# Altium schematic sheet 407-io.schdoc
size A4
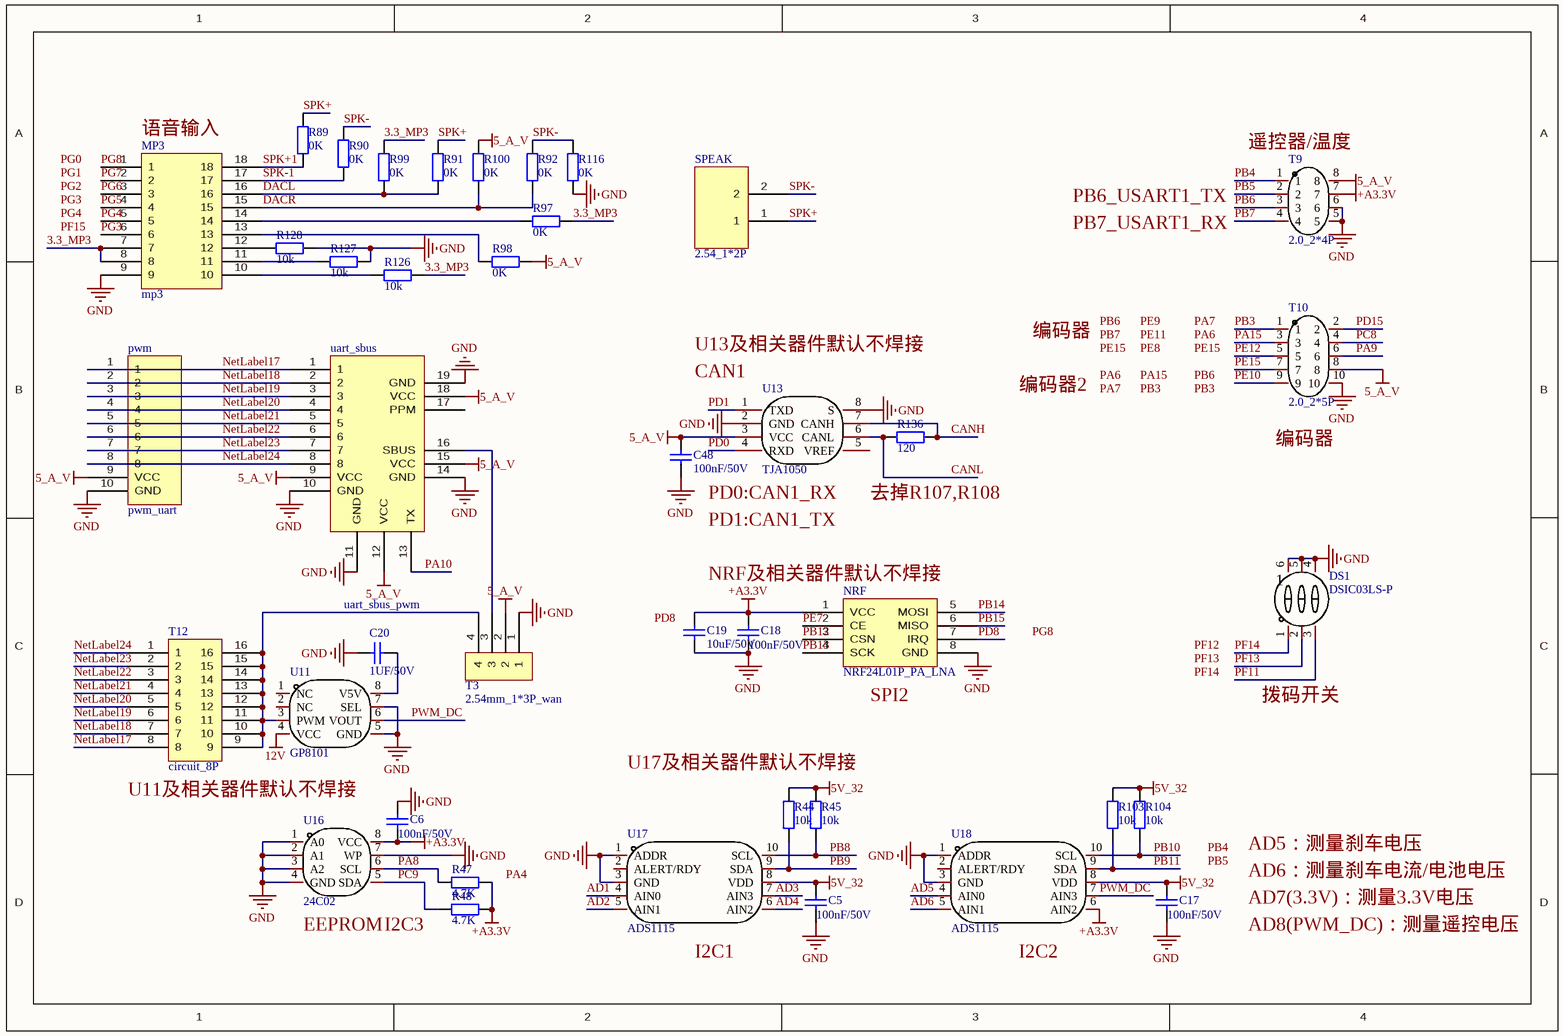
[diagram p0: 407-io.schdoc]

## Parts
C5  100nF/50V
C6  100nF/50V
C17  100nF/50V
C18  100nF/50V
C19  10uF/50V
C20  1UF/50V
C48  100nF/50V
DS1  DSIC03LS-P  [DS1040-03RN]
MP3  mp3  [MP3]
NRF  NRF24L01P_PA_LNA  [NRF24L01P_PA_LNA]
pwm  pwm_uart  [pwm_uart]
R44  10k  [R0603_L]
R45  10k  [R0603_L]
R47  4.7K
R48  4.7K
R89  0K  [R0603_L]
R90  0K  [R0603_L]
R91  0K  [R0603_L]
R92  0K  [R0603_L]
R97  0K  [R0603_L]
R98  0K  [R0603_L]
R99  0K  [R0603_L]
R100  0K  [R0603_L]
R103  10k  [R0603_L]
R104  10k  [R0603_L]
R116  0K  [R0603_L]
R126  10k  [R0603_L]
R127  10k  [R0603_L]
R128  10k  [R0603_L]
R136  120
SPEAK  2.54_1*2P  [2.54_1*2P]
T3  2.54mm_1*3P_wan
T9  2.0_2*4P  [2.0_2*4P]
T10  2.0_2*5P  [2.0_2*5P]
T12  circuit_8P  [circuit_8P]
U11  GP8101  [GP8101]
U13  TJA1050  [TJA1050]
U16  24C02  [24C02]
U17  ADS1115  [ADS1115]
U18  ADS1115  [ADS1115]
uart_sbus  uart_sbus_pwm  [uart_sbus_pwm]

## Nets
5_A_V: C48.2 pwm.9(VCC) R98.2 R100.2 T3.2 T9.8 T10.8 U13.3(VCC) uart_sbus.9(VCC) uart_sbus.12(VCC) uart_sbus.15(VCC) uart_sbus.18(VCC)
5V_32: C5.1 C17.1 R44.1 R45.1 R103.1 R104.1 U17.8(VDD) U18.8(VDD)
12V: U11.4(VCC)
+A3.3V: C6.2 C18.1 C19.1 NRF.1(VCC) R47.2 R48.2 T9.7 U16.8(VCC) U18.6(AIN2)
GND: C5.2 C6.1 C17.2 C18.2 C19.2 C20.2 C48.1 DS1.4(PIN4) DS1.5(PIN5) DS1.6(PIN6) MP3.9 NRF.8(GND) pwm.10(GND) R116.1 R127.2 R128.2 T3.1 T9.5 T9.6 T10.10 U11.5(GND) U11.7(SEL) U13.2(GND) U13.8(S) U16.1(A0) U16.2(A1) U16.3(A2) U16.4(GND) U16.7(WP) U17.1(ADDR) U17.3(GND) U18.1(ADDR) U18.3(GND) uart_sbus.10(GND) uart_sbus.11(GND) uart_sbus.14(GND) uart_sbus.19(GND)
3.3_MP3: MP3.7 MP3.8 R97.2 R99.2 R126.2
AD1: U17.4(AIN0)
AD2: U17.5(AIN1)
AD3: U17.7(AIN3)
AD4: U17.6(AIN2)
AD5: U18.4(AIN0)
AD6: U18.5(AIN1)
CANH: R136.2 U13.7(CANH)
CANL: R136.1 U13.6(CANL)
DACL: MP3.16 R91.1 R99.1
DACR: MP3.15 R92.1 R100.1
NetLabel17: pwm.1 T12.8 uart_sbus.1
NetLabel18: pwm.2 T12.7 uart_sbus.2
NetLabel19: pwm.3 T12.6 uart_sbus.3
NetLabel20: pwm.4 T12.5 uart_sbus.4
NetLabel21: pwm.5 T12.4 uart_sbus.5
NetLabel22: pwm.6 T12.3 uart_sbus.6
NetLabel23: pwm.7 T12.2 uart_sbus.7
NetLabel24: pwm.8 T12.1 uart_sbus.8
PA8: R47.1 U16.6(SCL)
PA9: T10.6
PA10: uart_sbus.13(TX)
PA15: T10.3
PB3: T10.1
PB4: T9.1
PB5: T9.2
PB6: T9.3
PB7: T9.4
PB8: R45.2 U17.10(SCL)
PB9: R44.2 U17.9(SDA)
PB10: R104.2 U18.10(SCL)
PB11: R103.2 U18.9(SDA)
PB12: NRF.3(CSN)
PB13: NRF.4(SCK)
PB14: NRF.5(MOSI)
PB15: NRF.6(MISO)
PC8: T10.4
PC9: R48.1 U16.5(SDA)
PD0: U13.4(RXD)
PD1: U13.1(TXD)
PD8: NRF.7(IRQ)
PD15: T10.2
PE7: NRF.2(CE)
PE10: T10.9
PE12: T10.5
PE15: T10.7
PF11: DS1.3(PIN3)
PF13: DS1.2(PIN2)
PF14: DS1.1(PIN1)
PG3: MP3.6
PG4: MP3.5
PG5: MP3.4
PG6: MP3.3
PG7: MP3.2
PG8: MP3.1
PWM_DC: U11.6(VOUT) U18.7(AIN3)
SPK+: R89.2 R91.2 SPEAK.1
SPK+1: MP3.18 R89.1
SPK-: R90.2 R92.2 R116.2 SPEAK.2
SPK-1: MP3.17 R90.1
NetC20_1: C20.1 U11.8(V5V)
NetMP3_10: MP3.10 R126.1
NetMP3_11: MP3.11 R127.1
NetMP3_12: MP3.12 R128.1
NetMP3_13: MP3.13 R98.1
NetMP3_14: MP3.14 R97.1
NetT3_3: T3.3 uart_sbus.16(SBUS)
NetT3_4: T3.4 T12.9 T12.10 T12.11 T12.12 T12.13 T12.14 T12.15 T12.16 U11.3(PWM)

Not connected (* = marked no-connect by the designer): U11 1(NC) 2(NC); U13 5(VREF); U17 2(ALERT/RDY); U18 2(ALERT/RDY); uart_sbus 17(PPM)

## Notes on the sheet
- (near MP3) 语音输入
- (near T9) 遥控器/温度
- PB6_USART1_TX
- PB7_USART1_RX
- (near U13) CAN1
- U13及相关器件默认不焊接
- 编码器
- 编码器2
- (near T10) 编码器
- PD0:CAN1_RX
- 去掉R107,R108
- PD1:CAN1_TX
- NRF及相关器件默认不焊接
- (near NRF) SPI2
- 拨码开关
- U17及相关器件默认不焊接
- (near T12) U11及相关器件默认不焊接
- AD5：测量刹车电压
- AD7(3.3V)：测量3.3V电压
- AD6：测量刹车电流/电池电压
- (near U16) EEPROM
- I2C3
- (near U17) I2C1
- (near U18) I2C2
- AD8(PWM_DC)：测量遥控电压
- Labels drawn without touching a wire or pin: PA4, PA6, PA7, PA15, PB3, PB4, PB5, PB6, PB7, PD8, PE8, PE9, PE11, PE15, PF12, PF13, PF14, PF15, PG0, PG1, PG2, PG3, PG4, PG8

## Library data of the parts
C5 C6 C17-C20 C48 = Cap: Capacitor; Published: 8-Jun-2000; LatestRevisionDate: 17-Jul-2002; LatestRevisionNote: Re-released for DXP Platform.; PackageReference: RAD-0.3; Publisher: Altium Limited; PackageDescription: Radial Cap, Thru-Hole; 2 Leads; 0.3 in Pin Spacing
  C5 C6 C17 C18 C48: Value: 100nF/50V
  C19: Value: 10uF/50V
  C20: Value: 1UF/50V
R44 R45 R103 R104 R126-R128 = Res2: Resistor; Value: 0K; Published: 8-Jun-2000; LatestRevisionDate: 17-Jul-2002; LatestRevisionNote: Re-released for DXP Platform.; PackageReference: AXIAL-0.4; Publisher: Altium Limited; PackageDescription: Axial Device, Thru-Hole; 2 Leads; 0.4 in Pin Spacing
R47 R48 R89-R92 R97-R100 R116 = Res2: Resistor; Published: 8-Jun-2000; LatestRevisionDate: 17-Jul-2002; LatestRevisionNote: Re-released for DXP Platform.; PackageReference: AXIAL-0.4; Publisher: Altium Limited; PackageDescription: Axial Device, Thru-Hole; 2 Leads; 0.4 in Pin Spacing
  R47 R48: Value: 4.7K
  R89-R92 R97-R100 R116: Value: 0K
R136 = Res2: Resistor; Value: 120R; Published: 8-Jun-2000; LatestRevisionDate: 17-Jul-2002; LatestRevisionNote: Re-released for DXP Platform.; PackageReference: AXIAL-0.4; Publisher: Altium Limited; PackageDescription: Axial Device, Thru-Hole; 2 Leads; 0.4 in Pin Spacing